# Altium schematic sheet DB10005_TopLevel.SchDoc: TopLevel schematic
size A3; SheetNumber: 1; SheetTotal: 7
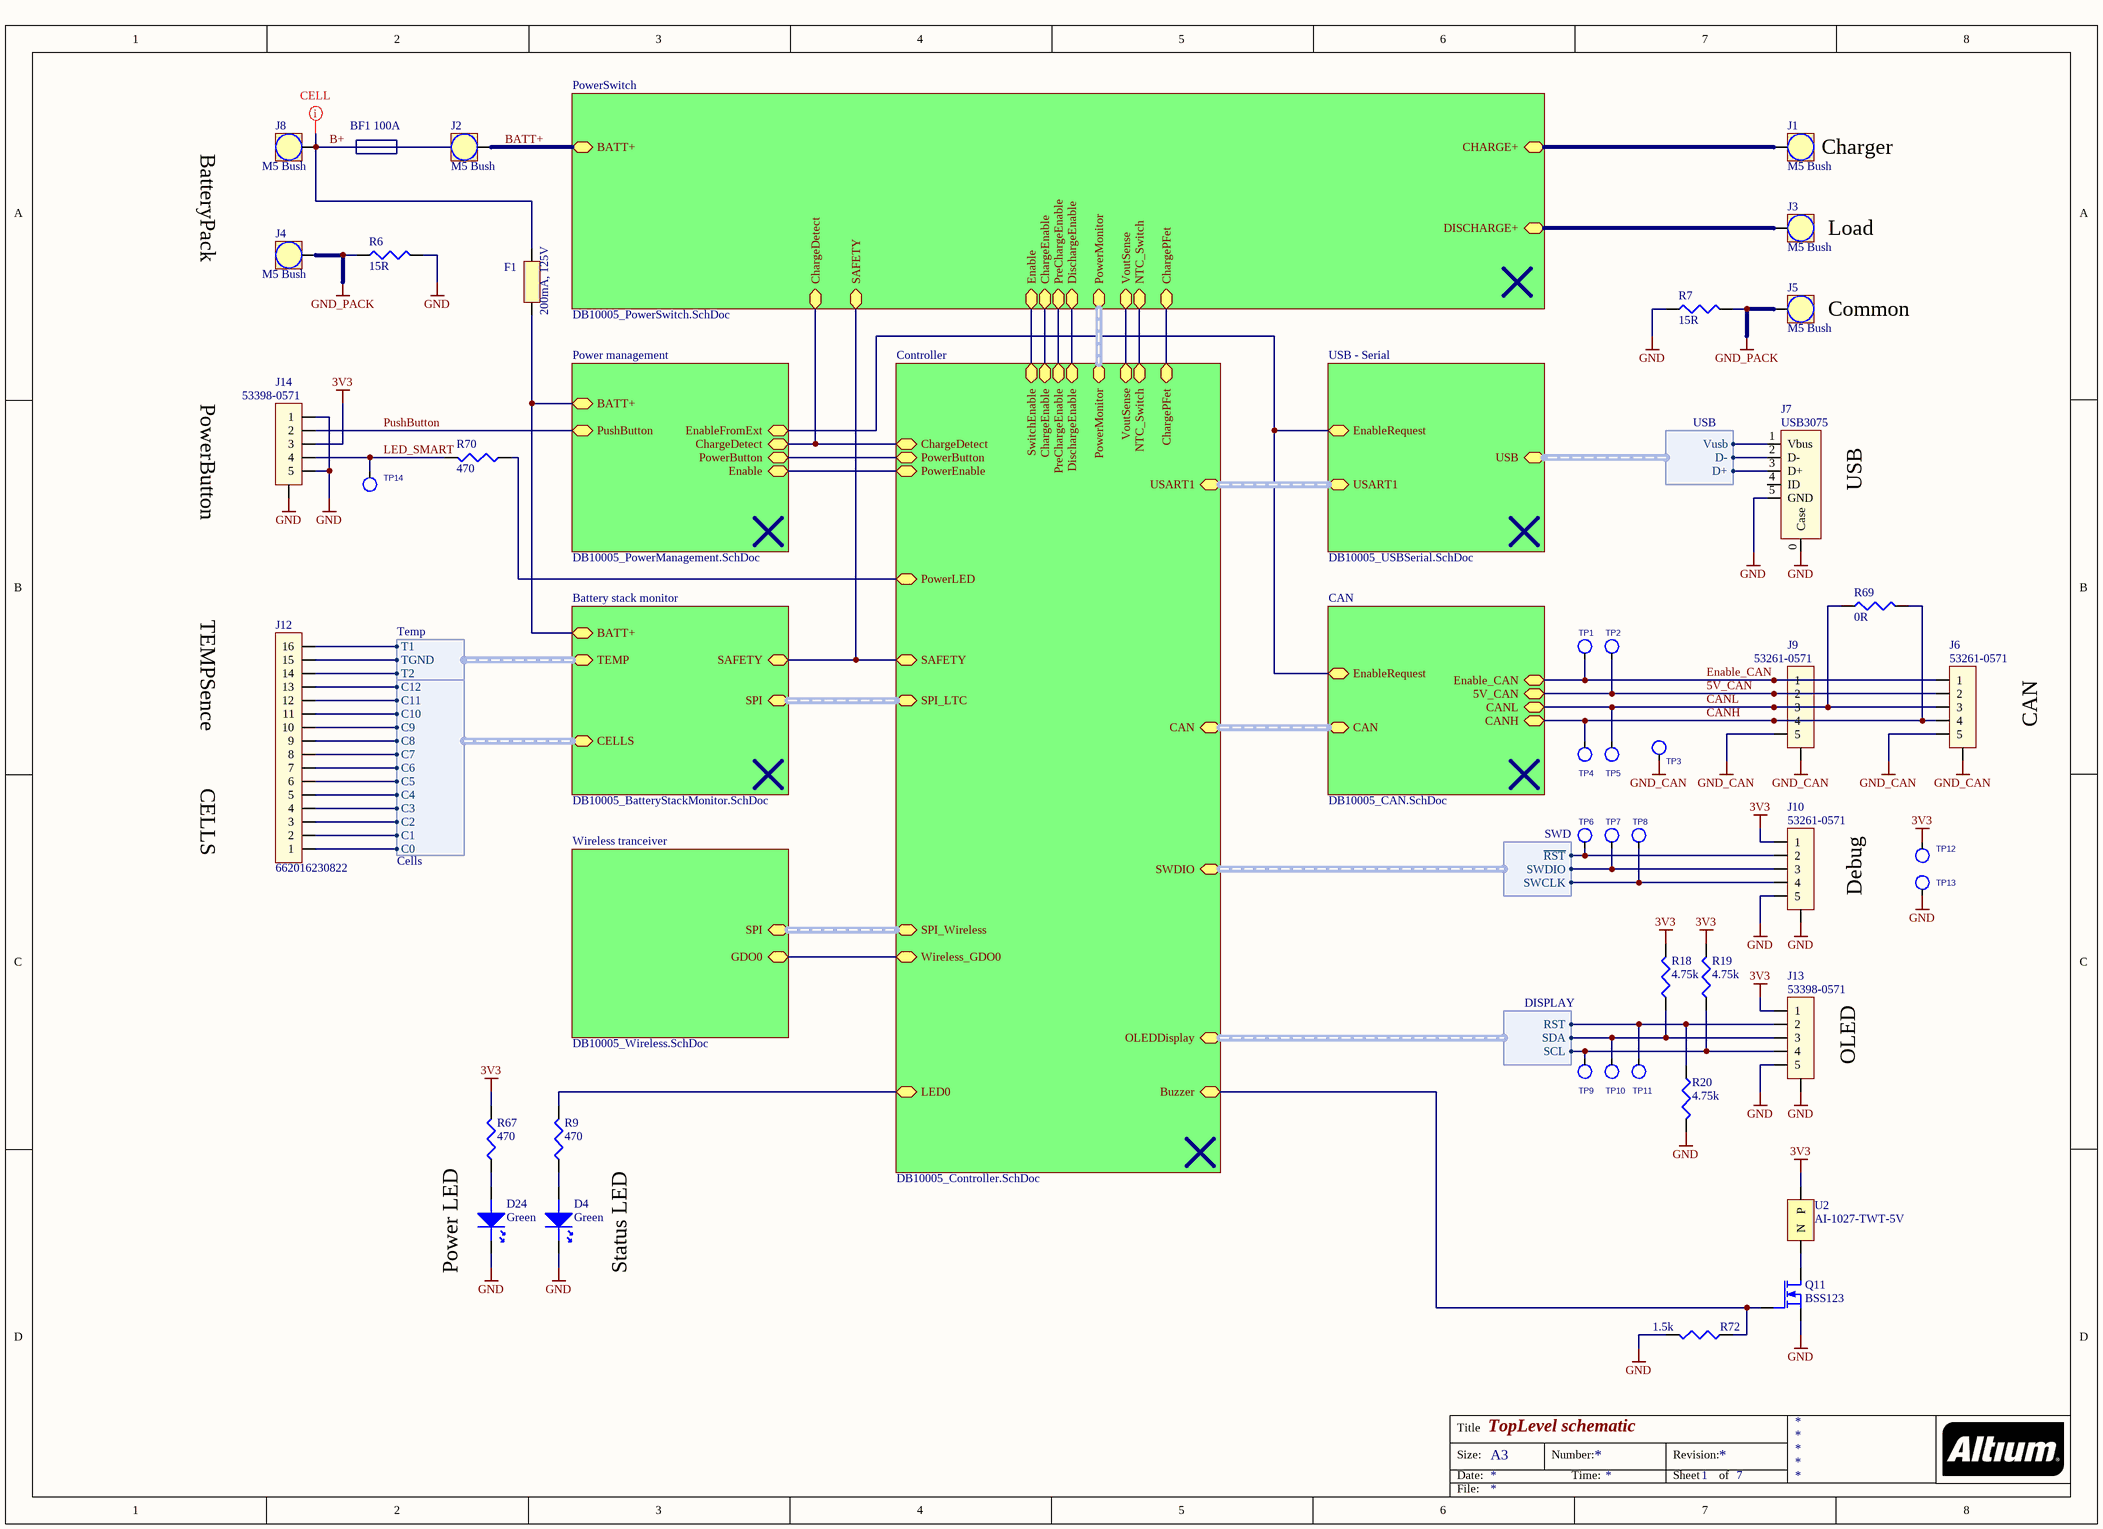
[diagram p0: DB10005_TopLevel.SchDoc]

## Parts
D4  Green  [D-0805]
D24  Green  [D-0805]
F1  200mA, 125V  [F1206]
J1  M5 Bush  [7460408_HAL Surface]
J2  M5 Bush  [7460408_HAL Surface]
J3  M5 Bush  [7460408_HAL Surface]
J4  M5 Bush  [7460408_HAL Surface]
J5  M5 Bush  [7460408_HAL Surface]
J6  53261-0571  [53261-0571]
J7  USB3075  [USB3075 - NOSLOT]
J8  M5 Bush  [7460408_HAL Surface]
J9  53261-0571  [53261-0571]
J10  53261-0571  [53261-0571]
J12  662016230822  [662016230822]
J13  53398-0571  [53398-0571]
J14  53398-0571  [53398-0571]
Q11  BSS123  [SOT-23]
R6  15R  [2512]
R7  15R  [2512]
R9  470  [0402]
R18  4.75k  [0402]
R19  4.75k  [0402]
R20  4.75k  [0402]
R67  470  [0402]
R69  0R  [0805]
R70  470  [0402]
R72  1.5k  [0402]
TP1  1.3TP  [TP2-1.3MM]  (value not drawn)  (no BOM)
TP2  1.3TP  [TP2-1.3MM]  (value not drawn)  (no BOM)
TP3  1.3TP  [TP2-1.3MM]  (value not drawn)  (no BOM)
TP4  1.3TP  [TP2-1.3MM]  (value not drawn)  (no BOM)
TP5  1.3TP  [TP2-1.3MM]  (value not drawn)  (no BOM)
TP6  1.3TP  [TP2-1.3MM]  (value not drawn)  (no BOM)
TP7  1.3TP  [TP2-1.3MM]  (value not drawn)  (no BOM)
TP8  1.3TP  [TP2-1.3MM]  (value not drawn)  (no BOM)
TP9  1.3TP  [TP2-1.3MM]  (value not drawn)  (no BOM)
TP10  1.3TP  [TP2-1.3MM]  (value not drawn)  (no BOM)
TP11  1.3TP  [TP2-1.3MM]  (value not drawn)  (no BOM)
TP12  1.3TP  [TP2-1.3MM]  (value not drawn)  (no BOM)
TP13  1.3TP  [TP2-1.3MM]  (value not drawn)  (no BOM)
TP14  1.3TP  [TP2-1.3MM]  (value not drawn)  (no BOM)
U2  AI-1027-TWT-5V  [AI-1027-TWT]

## Sub-sheets
Battery stack monitor = DB10005_BatteryStackMonitor.SchDoc: SPI (harness SPI), CELLS (harness Cells), TEMP (harness Temp), BATT+, SAFETY
CAN = DB10005_CAN.SchDoc: CANH, CAN (harness CAN), CANL, 5V_CAN, Enable_CAN, EnableRequest
Controller = DB10005_Controller.SchDoc: SPI_LTC (harness SPI), PowerEnable, PowerButton, DischargeEnable, ChargeEnable, SwitchEnable, PreChargeEnable, CAN (harness CAN), USART1 (harness SERIAL), ChargeDetect, OLEDDisplay (harness DISPLAY), PowerLED, LED0, PowerMonitor (harness ISL), SWDIO (harness SWD), VoutSense, Buzzer, SAFETY, NTC_Switch, SPI_Wireless (harness SPI), Wireless_GDO0, ChargePFet
Power management = DB10005_PowerManagement.SchDoc: Enable, PowerButton, ChargeDetect, EnableFromExt, PushButton, BATT+
PowerSwitch = DB10005_PowerSwitch.SchDoc: DischargeEnable, ChargeEnable, Enable, PreChargeEnable, ChargeDetect, CHARGE+, DISCHARGE+, BATT+, PowerMonitor (harness ISL), VoutSense, SAFETY, NTC_Switch, ChargePFet
USB - Serial = DB10005_USBSerial.SchDoc: USB (harness USB), USART1 (harness SERIAL), EnableRequest
Wireless tranceiver = DB10005_Wireless.SchDoc: SPI (harness SPI), GDO0

## Harnesses
USB: Vusb, D+, D-
Cells: C1, C9, C2, C3, C4, C5, C6, C7, C8, C10, C11, C0, C12
Temp: T1, T2, TGND
DISPLAY: SDA, SCL, RST
SWD: SWCLK, SWDIO, ~{RST}

## Nets
3V3: J10.1 J13.1 J14.3 R18.2 R19.2 R67.2 TP12.1(TP) U2.P
GND: D4.K D24.K J7.0(Case) J7.5(GND) J10.0(SHLD) J10.5 J13.0(SHLD) J13.5 J14.0(SHLD) J14.1 J14.5 Q11.S R6.2 R7.2 R20.2 R72.2 TP13.1(TP)
GND_CAN: J6.0(SHLD) J6.5 J9.0(SHLD) J9.5 TP3.1(TP)
GND_PACK: J4.1 J5.1 R6.1 R7.1
5V_CAN: J6.2 J9.2 TP2.1(TP) ; sheet CAN/5V_CAN
B+: F1.2 J8.1
BATT+: J2.1 ; sheet PowerSwitch/BATT+
CANH: J6.4 J9.4 R69.2 TP4.1(TP) ; sheet CAN/CANH
CANL: J6.3 J9.3 R69.1 TP5.1(TP) ; sheet CAN/CANL
Enable_CAN: J6.1 J9.1 TP1.1(TP) ; sheet CAN/Enable_CAN
LED_SMART: J14.4 R70.2 TP14.1(TP)
PushButton: J14.2 ; sheet Power management/PushButton
NetD4_A: D4.A R9.1
NetD24_A: D24.A R67.1
NetF1_1: F1.1 ; sheet Battery stack monitor/BATT+, sheet Power management/BATT+
NetJ1_1: J1.1 ; sheet PowerSwitch/CHARGE+
NetJ3_1: J3.1 ; sheet PowerSwitch/DISCHARGE+
NetJ7_1: J7.1(Vbus) ; sheet USB - Serial/USB.Vusb
NetJ7_2: J7.2(D-) ; sheet USB - Serial/USB.D-
NetJ7_3: J7.3(D+) ; sheet USB - Serial/USB.D+
NetJ10_2: J10.2 TP6.1(TP) ; sheet Controller/SWDIO.~{RST}
NetJ10_3: J10.3 TP7.1(TP) ; sheet Controller/SWDIO.SWDIO
NetJ10_4: J10.4 TP8.1(TP) ; sheet Controller/SWDIO.SWCLK
NetJ12_1: J12.1 ; sheet Battery stack monitor/CELLS.C0
NetJ12_2: J12.2 ; sheet Battery stack monitor/CELLS.C1
NetJ12_3: J12.3 ; sheet Battery stack monitor/CELLS.C2
NetJ12_4: J12.4 ; sheet Battery stack monitor/CELLS.C3
NetJ12_5: J12.5 ; sheet Battery stack monitor/CELLS.C4
NetJ12_6: J12.6 ; sheet Battery stack monitor/CELLS.C5
NetJ12_7: J12.7 ; sheet Battery stack monitor/CELLS.C6
NetJ12_8: J12.8 ; sheet Battery stack monitor/CELLS.C7
NetJ12_9: J12.9 ; sheet Battery stack monitor/CELLS.C8
NetJ12_10: J12.10 ; sheet Battery stack monitor/CELLS.C9
NetJ12_11: J12.11 ; sheet Battery stack monitor/CELLS.C10
NetJ12_12: J12.12 ; sheet Battery stack monitor/CELLS.C11
NetJ12_13: J12.13 ; sheet Battery stack monitor/CELLS.C12
NetJ12_14: J12.14 ; sheet Battery stack monitor/TEMP.T2
NetJ12_15: J12.15 ; sheet Battery stack monitor/TEMP.TGND
NetJ12_16: J12.16 ; sheet Battery stack monitor/TEMP.T1
NetJ13_2: J13.2 R20.1 TP11.1(TP) ; sheet Controller/OLEDDisplay.RST
NetJ13_3: J13.3 R18.1 TP10.1(TP) ; sheet Controller/OLEDDisplay.SDA
NetJ13_4: J13.4 R19.1 TP9.1(TP) ; sheet Controller/OLEDDisplay.SCL
NetQ11_D: Q11.D U2.N
NetQ11_G: Q11.G R72.1 ; sheet Controller/Buzzer
NetR9_2: R9.2 ; sheet Controller/LED0
NetR70_1: R70.1 ; sheet Controller/PowerLED
(unnamed): sheet Battery stack monitor/SAFETY, sheet Controller/SAFETY, sheet PowerSwitch/SAFETY
(unnamed): sheet Controller/PowerEnable, sheet Power management/Enable
(unnamed): sheet Controller/PowerButton, sheet Power management/PowerButton
(unnamed): sheet Controller/DischargeEnable, sheet PowerSwitch/DischargeEnable
(unnamed): sheet Controller/ChargeEnable, sheet PowerSwitch/ChargeEnable
(unnamed): sheet Controller/SwitchEnable, sheet PowerSwitch/Enable
(unnamed): sheet Controller/PreChargeEnable, sheet PowerSwitch/PreChargeEnable
(unnamed): sheet Controller/ChargeDetect, sheet PowerSwitch/ChargeDetect, sheet Power management/ChargeDetect
(unnamed): sheet Controller/VoutSense, sheet PowerSwitch/VoutSense
(unnamed): sheet Controller/NTC_Switch, sheet PowerSwitch/NTC_Switch
(unnamed): sheet Controller/Wireless_GDO0, sheet Wireless tranceiver/GDO0
(unnamed): sheet Controller/ChargePFet, sheet PowerSwitch/ChargePFet
(unnamed): sheet Power management/EnableFromExt, sheet CAN/EnableRequest, sheet USB - Serial/EnableRequest

Not connected (* = marked no-connect by the designer): J7 4(ID)

## Buses and harness runs
harness sheet Battery stack monitor/SPI = sheet Controller/SPI_LTC
harness sheet CAN/CAN = sheet Controller/CAN
harness sheet Controller/PowerMonitor = sheet PowerSwitch/PowerMonitor
harness sheet Controller/SPI_Wireless = sheet Wireless tranceiver/SPI
harness sheet Controller/USART1 = sheet USB - Serial/USART1

## Layout directives
net class CELL: B+

## Notes on the sheet
- (near J8) BF1 100A
- BatteryPack
- (near J1) Charger
- (near J3) Load
- (near J5) Common
- PowerButton
- (near J7) USB
- TEMPSence
- CAN
- CELLS
- Debug
- (near J13) OLED
- Power LED
- Status LED
- Title
- Size:
- Date:
- A3
- Number:
- Time:
- Revision:
- Sheet
- of
- File:

## Library data of the parts
D4 D24 = KP-2012SGC: Led, Green, Li:12mcd, Vf:2.2V, If:0.02A; Brand: KingBright; Case Style: 0805; Forward Current: 0.02A; Forward Voltage: 2.2V; Luminous Intensity: 12mcd; Brand Number: KP-2012SGC; Order Code Supplier: 1318243; Price: 0,06; Supplier: Farnell; Temperature Range: -30°C to +85°C
F1 = 0466.200NR: Fuse, Slow Blow, 200 mA, 125 VAC, 125 VDC; Brand: LITTELFUSE; Prijs: 0,347; Order Code Supplier: 1596522; Brand Number: 0466.200NR; Supplier: Farnell
J1-J5 J8 = 7460408: Bush with Circumference M5; Brand: Wurth; Case Style: M5Bush; Brand Number: 7460408; Order Code Supplier: 1821279; Price: 4,17; Supplier: Farnell
J6 J9 J10 = 53261-0571: PicoBlade 53261 Series, 5Pin, Right Angle; Brand: MOLEX; Pitch: 1.25mm; Brand Number: 53261-0571; Case Style: 53261-0571; Order Code Supplier: 1125360; Price: 1,20; Supplier: Farnell
J7 = USB3075: USB 2.0 MICRO B, RCPT, 5POS, SMT; Brand: Global Connector Technology; Brand Number: USB3075-30-A; Case Style: Micro B SMT; Pitch: 0.8mm; Order Code Supplier: 2443116; Price: 0,313; Supplier: Farnell
J12 = 662016230822: WR-MPC3 Series, Surface Mount, Header, 16 Contacts, 3 mm; Brand: Wurth; Case Style: 3mm BoxHeader; Pitch: 3mm; Brand Number: 662016230822; Order Code Supplier: 2113471; Price: 2,67; Supplier: Farnell
J13 J14 = 53398-0571: PicoBlade 53398 Series, 5Pin, Right Angle; Brand: MOLEX; Pitch: 1.25mm; Brand Number: 53398-0571; Case Style: 53398-0571; Order Code Supplier: 1125354; Price: 1,55; Supplier: Farnell
Q11 = BSS123: Mosfet, N-channel, Vds:100V, Id:0.15A, Vgs-th:2.8V, Rds-on:3.5ohm; Brand: NXP; Drain Current: 0.15A; Drain Source Voltage: 100V; Gate Source Voltage: 20V; On Resistance: 3.5ohm; Threshold Voltage: 2.8V; Brand Number: BSS123; Case Style: SOT-23; Order Code Supplier: 1510764; Price: 0,082; Supplier: Farnell; Temperature Range: -55°C to +150°C; Transistor Polarity: N-channel
R6 R7 = 15/2512/2W/250V: Resistor, 15R, 1%, 2W, 200V, 200PPM, 2512; Brand: TE CONNECTIVITY / CGS; Brand Number: 352115RFT; Voltage Rating: 250V; Case Style: 2512; Order Code Supplier: 2117454; Power Rating: 2W; Price: 0,30; Resistance: 15R; Supplier: Farnell; Temperature Coefficient: ± 200PPM; Temperature Range: -55°C to +125°C
R9 R67 R70 = 470/0402/0063W/50V: Resistor, 470, 1%, 0.0625W, 50V, 100PPM, 0402; Brand: VISHAY DRALORIC; Brand Number: CRG0402F470R; Power Rating: 0.063W; Case Style: 0402; Order Code Supplier: 2331533; Price: 0,0099; Resistance: 470; Supplier: Farnell; Temperature Coefficient: ± 100PPM; Temperature Range: -55°C to +125°C; Voltage Rating: 50V
R18-R20 = 4.75k/0402/0063W/50V: Resistor, 4.75k, 0.1%, 0.0625W, 50V, 100PPM, 0402; Brand: VISHAY DRALORIC; Brand Number: CRCW04024K75FKED; Power Rating: 0.063W; Case Style: 0402; Order Code Supplier: 2121689; Price: 0,0006; Resistance: 4.75k; Supplier: Farnell; Temperature Coefficient: ± 100PPM; Temperature Range: -55°C to +125°C; Voltage Rating: 50V
R69 = 0/0805/0100W/150V: Resistor, 0R, 0.1%, 0.1W, 150V, 200PPM, 0805; Brand: MULTICOMP; Brand Number: MC 0.1W 0805 0R; Case Style: 0805; Order Code Supplier: 9333681; Power Rating: 0.1W; Price: 0,038; Resistance: 0R; Supplier: Farnell; Temperature Coefficient: ± 200PPM; Temperature Range: -55°C to +125°C; Voltage Rating: 150V
R72 = 1.5k/0402/0063W/50V: Resistor, 1.5k, 0.1%, 0.0625W, 50V, 100PPM, 0402; Brand: VISHAY DRALORIC; Brand Number: CRCW04021K50FKED; Power Rating: 0.063W; Case Style: 0402; Order Code Supplier: 2121624; Price: 0,0054; Resistance: 1.5k; Supplier: Farnell; Temperature Coefficient: ± 100PPM; Temperature Range: -55°C to +125°C; Voltage Rating: 50V
TP1-TP14 = TESTPT4: 1.3mm
U2 = AI-1027-TWT-5V-2-R: EM 5VDC 2300Hz 82dBA Continuous Top Fire; Brand: PUI Audio; Brand Number: AI-1027-TWT-5V-2-R; Case Style: AI-1027-TWT-5V-2-R; Price: 1,73; Order Code Supplier: 665-AI1027TWT5V2R; Supplier: Mouser